# EAGLE design interface (EAGLE 6.2)
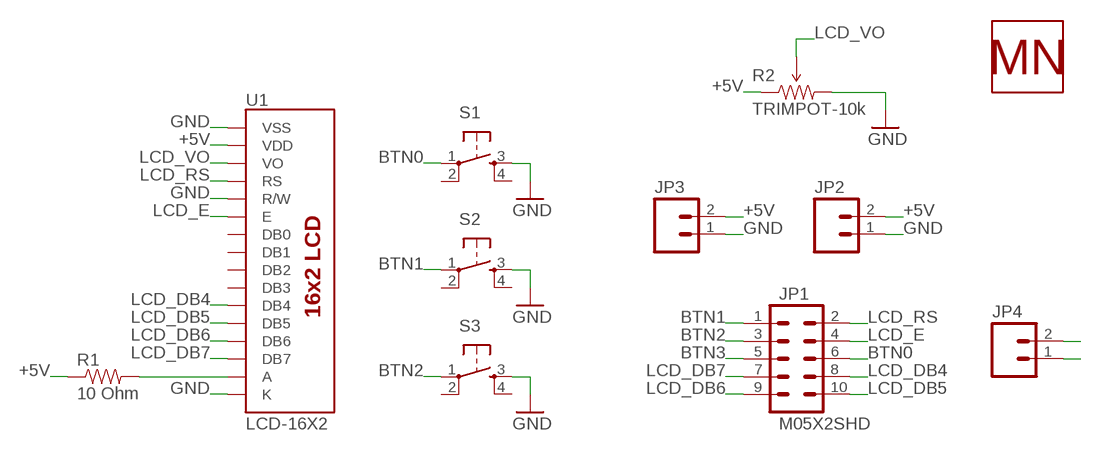
[diagram p0: schematic, sheet 1]

## Parts
JP1  M05X2SHD  [2X5-SHROUDED]
JP2  M02POLAR  [MOLEX-1X2]
JP3  M02PTH  [1X02]
JP4  M02PTH  [1X02]
R1  10 Ohm  RESISTOR1206  [1206]
R2  TRIMPOT-10k  TRIMPOT-2  [TRIMPOT_TC33]
S1  TAC_SWITCHPTH  [TACTILE-PTH]
S2  TAC_SWITCHPTH  [TACTILE-PTH]
S3  TAC_SWITCHPTH  [TACTILE-PTH]
U1  LCD-16X2  [LCD-16X2_NOLEFTDRILL]
U$5  MN-LOGO  [MN-LOGO]

## Nets
+5V: JP2.2 JP3.2 R1.1 R2.1(CCW) U1.2(VDD)
BTN0: JP1.6 S1.1
BTN1: JP1.1 S2.1
BTN2: JP1.3 S3.1
BTN3: JP1.5 JP4.2
GND: JP2.1 JP3.1 JP4.1 R2.3(CW) S1.3 S2.3 S3.3 U1.1(VSS) U1.5(R/W) U1.16(K)
LCD_DB4: JP1.8 U1.11(DB4)
LCD_DB5: JP1.10 U1.12(DB5)
LCD_DB6: JP1.9 U1.13(DB6)
LCD_DB7: JP1.7 U1.14(DB7)
LCD_E: JP1.4 U1.6(E)
LCD_RS: JP1.2 U1.4(RS)
LCD_VO: R2.2(WIPER) U1.3(VO)
N$1: R1.2 U1.15(A)
Unconnected: S1.2 S1.4 S2.2 S2.4 S3.2 S3.4 U1.7(DB0) U1.8(DB1) U1.9(DB2) U1.10(DB3)

## Library data of the parts
JP1 = SparkFun-Connectors:M05X2: Header 5x2 Standard 10-pin dual row 0.1" header. Commonly used with AVR-ISP. Use with Spark Fun Electronics SKU: PRT-00778
JP2-JP4 = SparkFun-Connectors:M02: Header 2 Standard 2-pin 0.1" header. Use with straight break away headers (SKU : PRT-00116), right angle break away headers (PRT-00553), swiss pins (PRT-00743), machine pins (PRT-00117), and female headers (PRT-00115). Molex polarized connector foot print use with SKU : PRT-08233 with associated crimp pins and housings.
R1 = SparkFun-Resistors:RESISTOR: Resistor Basic schematic elements and footprints for 0603, 1206, and PTH resistors.
R2 = SparkFun-Electromechanical:TRIMPOT: Various small potentiometers for "set-and-forget" applications
S1-S3 = SparkFun-Electromechanical:TAC_SWITCH: Momentary Switch Button commonly used for reset or general input. Spark Fun Electronics SKU : COM-00097 SMT- SWCH-08247
U1 = Mikes-Display:LCD-16X2: Standard text-only 16x2 parallel input LCD
U$5 = Mikes-Aesthetics:MN-LOGO: Simple Logo with my initials

## Net classes
0 default: width 0.254 mm, drill 0.508 mm, clearance 0.254 mm

## Board
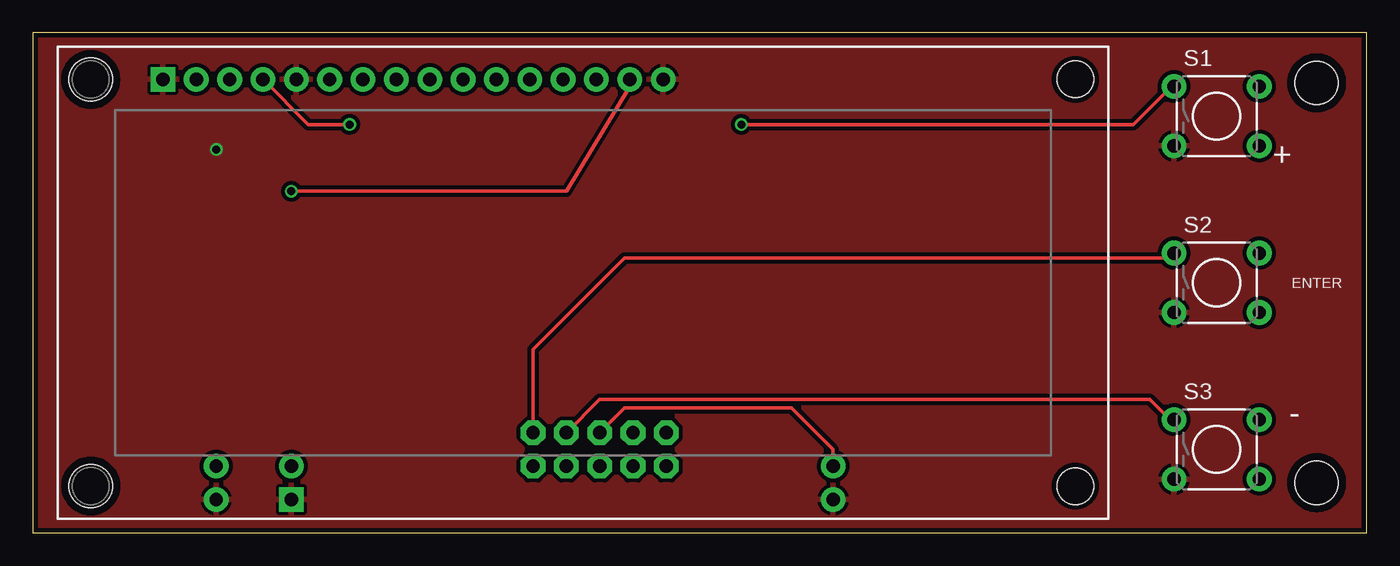
[diagram p1: board, top side]
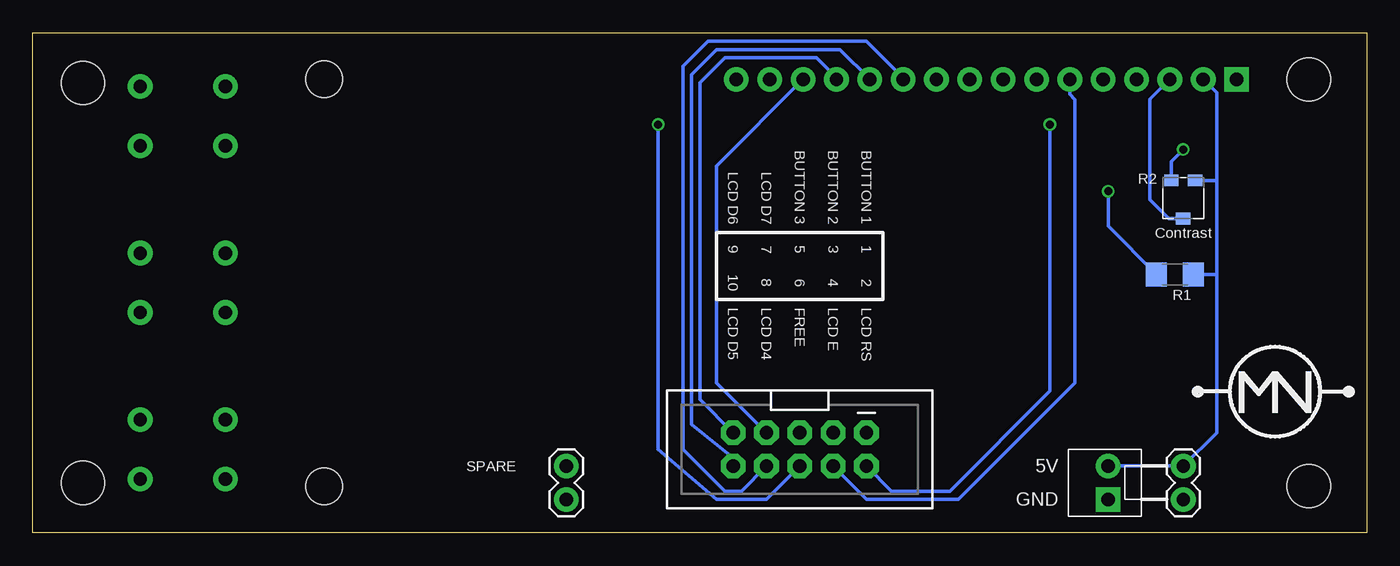
[diagram p2: board, bottom side, seen from below]

Size 101.6 x 38.1 mm. Coordinates in mm from the lower left corner, seen from the top.
Outline: 0,0 101.6,0 101.6,38.1 0,38.1 0,0
Copper layers (1*16): Top 0.0356mm / dielectric 1.5011mm / Bottom 0.0356mm
Design rules: minimum track width 6mil, minimum drill 13mil, track to track 6mil, track to pad 6mil, pad to pad 6mil, via to via 6mil, smd to smd 6mil, copper to edge 15mil, drill to drill 6mil, minimum pad ring 7mil, minimum via ring 7mil, stop-mask expansion 4mil, vias tented up to drill 0mil, thermal gap 10mil

### Footprints (pad centres in the part's own frame; a part is rotated, then mirrored left to right if it is on the bottom)
2X5-SHROUDED = drill 1.016 pad 1.88 octagon: 1 -1.27,5.08; 2 1.27,5.08; 3 -1.27,2.54; 4 1.27,2.54; 5 -1.27,0; 6 1.27,0; 7 -1.27,-2.54; 8 1.27,-2.54; 9 -1.27,-5.08; 10 1.27,-5.08
MOLEX-1X2 = drill 1.016 pad 1.88 square: 1 0,0 | drill 1.016 pad 1.88: 2 2.54,0
1X02 = drill 1.016 pad 1.88: 1 0,0; 2 2.54,0
1206 = smd 1.6 x 1.8: 1 -1.4,0; 2 1.4,0
TRIMPOT_TC33 = smd 1.1 x 0.9: 1 -0.91,-1.45; 2 0,1.45; 3 0.91,-1.45
TACTILE-PTH = drill 1.016 pad 1.88: 1 -3.251,2.261; 2 3.251,2.261; 3 -3.251,-2.261; 4 3.251,-2.261
LCD-16X2_NOLEFTDRILL = drill 1.016 pad 1.88 square: 1 -32,15.5 | drill 1.016 pad 1.88: 2 -29.46,15.5; 3 -26.92,15.5; 4 -24.38,15.5; 5 -21.84,15.5; 6 -19.3,15.5; 7 -16.76,15.5; 8 -14.22,15.5; 9 -11.68,15.5; 10 -9.14,15.5; 11 -6.6,15.5; 12 -4.06,15.5; 13 -1.52,15.5; 14 1.02,15.5; 15 3.56,15.5; 16 6.1,15.5 | hole 2.8: 37.5,15.5; 37.5,-15.5
STAND-OFF = hole 3.302: 0,0

### Placement (x,y rotation side)
JP1  43.18,6.35 270 bottom
JP2  19.68,2.54 90 bottom
JP3  13.97,2.54 90 bottom
JP4  60.96,2.54 90 bottom
R1  14.61,19.68 180 bottom
R2  13.97,25.4 180 bottom
S1  90.17,31.75 0 top
S2  90.17,19.05 0 top
S3  90.17,6.35 0 top
U1  41.91,19.05 0 top
U$1  [STAND-OFF]  97.79,34.29 0 top
U$2  [STAND-OFF]  97.79,3.81 0 top
U$3  [STAND-OFF]  4.41,34.55 0 top
U$4  [STAND-OFF]  4.41,3.56 0 top
U$5  6.99,10.79 0 bottom

### Tracks (layer width: path | path; a pad name or v marks a point on that pad's centre or on a via)
+5V
  Bottom 0.254: R2.1 11.43,26.85 | 11.43,26.85 11.43,33.53 U1.2 | 11.43,19.68 11.43,26.85 | R1.1 11.43,19.68 | JP2.2 JP3.2 11.43,7.62 11.43,19.68
BTN0  (via drill 0.6)
  Top 0.254: S1.1 86.72,34.01 83.82,31.11 v53.98,31.11
  Bottom 0.254: v53.98,31.11 53.98,6.35 49.53,2.54 45.72,2.54 JP1.6
BTN1
  Top 0.254: JP1.1 38.1,13.97 45.09,20.95 86.56,20.95 S2.1
BTN2
  Top 0.254: S3.1 86.64,8.61 85.09,10.16 43.18,10.16 JP1.3
BTN3
  Top 0.254: JP1.5 45.09,9.53 57.78,9.53 60.96,6.35 JP4.2
GND  (via drill 0.6)
  Bottom 0.254: R2.3 14.88,28.3 v13.97,29.21
  pour Top (isolate 0.305): 0,38.1 101.6,38.1 101.6,0 0,0
LCD_DB4
  Bottom 0.254: U1.11 35.31,34.67 38.1,37.47 50.16,37.47 52.07,35.56 52.07,6.35 48.9,3.17 47.62,3.17 JP1.8
LCD_DB5
  Bottom 0.254: JP1.10 48.26,5.71 51.44,8.26 51.44,34.92 49.53,36.83 40.13,36.83 U1.12
LCD_DB6
  Bottom 0.254: U1.13 40.39,34.67 41.91,36.2 48.9,36.2 50.8,34.29 50.8,10.16 JP1.9
LCD_DB7
  Bottom 0.254: JP1.7 49.53,11.43 49.53,27.95 U1.14
LCD_E
  Bottom 0.254: U1.6 22.61,33.41 22.23,33.02 22.23,11.43 31.11,2.54 38.1,2.54 JP1.4
LCD_RS  (via drill 0.6)
  Top 0.254: v24.13,31.11 20.96,31.11 U1.4
  Bottom 0.254: JP1.2 36.2,3.17 31.75,3.17 24.13,10.79 v24.13,31.11
LCD_VO
  Bottom 0.254: R2.2 15.06,23.95 16.51,25.4 16.51,33.03 U1.3
N$1  (via drill 0.6)
  Top 0.254: U1.15 45.47,34.04 40.64,26.04 v19.68,26.04
  Bottom 0.254: v19.68,26.04 19.68,23.36 R1.2

### Text on the board
tPlace: + | ENTER | -
bPlace: Contrast | BUTTON 1 | BUTTON 2 | BUTTON 3 | LCD D7 | LCD D6 | 1 | 3 | 5 | 7 | 9 | 2 | 4 | 6 | 8 | 10 | LCD RS | LCD E | FREE | LCD D4 | LCD D5 | 5V | SPARE | GND